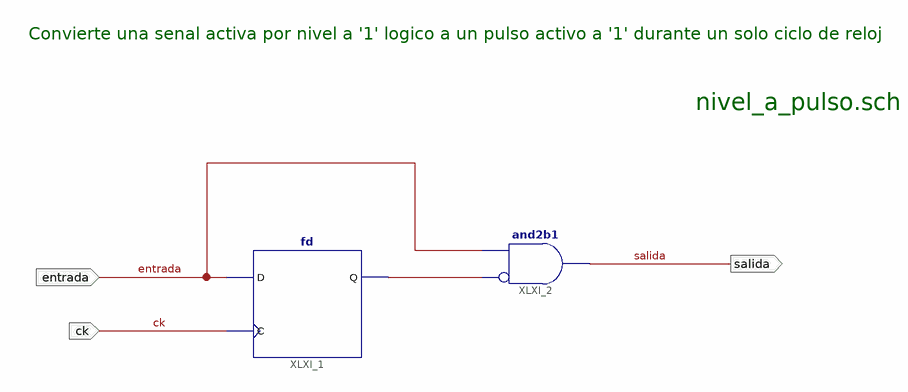
[diagram p0: schematic sheet 1]
// Xilinx ISE schematic nivel_a_pulso.sch (spartan6) as structural Verilog: 2 symbols, 3 ports
module nivel_a_pulso (
  input  ck,
  input  entrada,
  output salida
);

  wire XLXN_1;

  fd XLXI_1 (.C(ck), .D(entrada), .Q(XLXN_1));
  and XLXI_2 (salida, ~XLXN_1, entrada);  // and2b1

  // Notes on the sheet:
  //   Convierte una senal activa por nivel a '1' logico a un pulso activo a '1' durante un solo ciclo de reloj
  //   nivel_a_pulso.sch
endmodule
